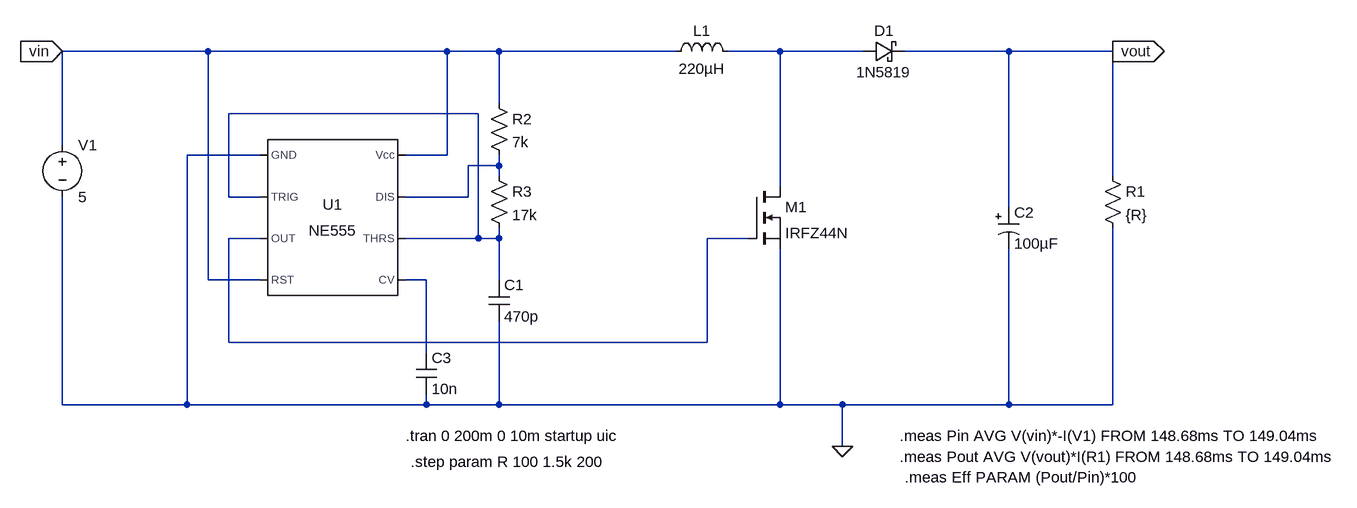
[diagram p0: schematic Ne555 (1).asc]
Ne555 (1).asc, the LTspice schematic file:
Version 4
SHEET 1 1904 936
WIRE 112 -16 -112 -16
WIRE 480 -16 112 -16
WIRE 560 -16 480 -16
WIRE 832 -16 560 -16
WIRE 992 -16 912 -16
WIRE 1120 -16 992 -16
WIRE 1344 -16 1184 -16
WIRE 1504 -16 1344 -16
WIRE 560 64 560 -16
WIRE 528 80 144 80
WIRE -112 128 -112 -16
WIRE 192 144 80 144
WIRE 480 144 480 -16
WIRE 480 144 416 144
WIRE 560 160 560 144
WIRE 560 160 512 160
WIRE 560 176 560 160
WIRE 1504 176 1504 -16
WIRE 992 192 992 -16
WIRE 144 208 144 80
WIRE 192 208 144 208
WIRE 512 208 512 160
WIRE 512 208 416 208
WIRE 1344 224 1344 -16
WIRE 192 272 144 272
WIRE 528 272 528 80
WIRE 528 272 416 272
WIRE 560 272 560 256
WIRE 560 272 528 272
WIRE 944 272 880 272
WIRE 112 336 112 -16
WIRE 192 336 112 336
WIRE 448 336 416 336
WIRE 560 336 560 272
WIRE 144 432 144 272
WIRE 880 432 880 272
WIRE 880 432 144 432
WIRE 448 448 448 336
WIRE -112 528 -112 208
WIRE 80 528 80 144
WIRE 80 528 -112 528
WIRE 448 528 448 512
WIRE 448 528 80 528
WIRE 560 528 560 400
WIRE 560 528 448 528
WIRE 992 528 992 288
WIRE 992 528 560 528
WIRE 1088 528 992 528
WIRE 1344 528 1344 288
WIRE 1344 528 1088 528
WIRE 1504 528 1504 256
WIRE 1504 528 1344 528
WIRE 1088 592 1088 528
FLAG 1088 592 0
FLAG -112 -16 vin
IOPIN -112 -16 In
FLAG 1504 -16 vout
IOPIN 1504 -16 Out
SYMBOL voltage -112 112 R0
WINDOW 123 0 0 Left 0
WINDOW 39 0 0 Left 0
SYMATTR InstName V1
SYMATTR Value 5
SYMBOL ind 816 0 R270
WINDOW 0 32 56 VTop 2
WINDOW 3 5 56 VBottom 2
SYMATTR InstName L1
SYMATTR Value 220µH
SYMBOL schottky 1120 0 R270
WINDOW 0 32 32 VTop 2
WINDOW 3 0 32 VBottom 2
SYMATTR InstName D1
SYMATTR Value 1N5819
SYMATTR Description Diode
SYMATTR Type diode
SYMBOL polcap 1328 224 R0
SYMATTR InstName C2
SYMATTR Value 100µF
SYMBOL nmos 944 192 R0
SYMATTR InstName M1
SYMATTR Value IRFZ44N
SYMBOL res 1488 160 R0
SYMATTR InstName R1
SYMATTR Value {R}
SYMBOL Misc\\NE555 304 240 R0
SYMATTR InstName U1
SYMBOL res 544 48 R0
SYMATTR InstName R2
SYMATTR Value 7k
SYMBOL res 544 160 R0
SYMATTR InstName R3
SYMATTR Value 17k
SYMBOL cap 544 336 R0
SYMATTR InstName C1
SYMATTR Value 470p
SYMBOL cap 432 448 R0
SYMATTR InstName C3
SYMATTR Value 10n
TEXT 416 576 Left 2 !.tran 0 200m 0 10m startup uic
TEXT 1176 576 Left 2 !.meas Pin AVG V(vin)*-I(V1) FROM 148.68ms TO 149.04ms
TEXT 1176 608 Left 2 !.meas Pout AVG V(vout)*I(R1) FROM 148.68ms TO 149.04ms
TEXT 1184 640 Left 2 !.meas Eff PARAM (Pout/Pin)*100
TEXT 424 616 Left 2 !.step param R 100 1.5k 200

The netlist it stands for:
* Ne555 (1).asc
V1 vin 0 5
L1 vin N001 220µH
D1 N001 vout 1N5819
C2 vout 0 100µF
M1 N001 N004 0 0 IRFZ44N
R1 vout 0 {R}
XU1 0 N002 N004 vin N005 N002 N003 vin NE555  ; pins GND TRIG OUT RST CV THRS DIS Vcc
R2 vin N003 7k
R3 N003 N002 17k
C1 N002 0 470p
C3 N005 0 10n
.model D D
.lib standard.dio
.model NMOS NMOS
.model PMOS PMOS
.lib standard.mos
.tran 0 200m 0 10m startup uic
.meas Pin AVG V(vin)*-I(V1) FROM 148.68ms TO 149.04ms
.meas Pout AVG V(vout)*I(R1) FROM 148.68ms TO 149.04ms
.meas Eff PARAM (Pout/Pin)*100
.step param R 100 1.5k 200
.lib NE555.sub
.backanno
.end